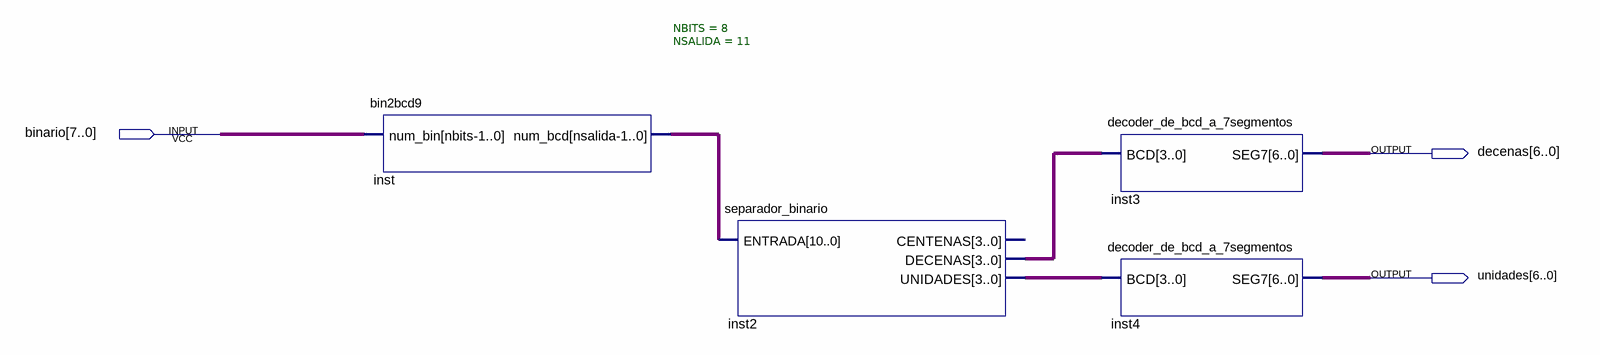
[diagram p0: schematic sheet]
// Quartus schematic convertidor_prueba.bdf as structural Verilog: 4 symbols, 3 pins
module convertidor_prueba (
  input  [7:0] binario,
  output [6:0] decenas,
  output [6:0] unidades
);

  wire [3:0] inst2_decenas, inst2_unidades;
  wire [10:0] inst_num_bcd;

  bin2bcd9 #(.NBITS(8), .NSALIDA(11)) inst (.num_bin(binario), .num_bcd(inst_num_bcd));
  separador_binario inst2 (
    .ENTRADA(inst_num_bcd), .DECENAS(inst2_decenas), .UNIDADES(inst2_unidades));  // open: CENTENAS
  decoder_de_bcd_a_7segmentos inst3 (.BCD(inst2_decenas), .SEG7(decenas));
  decoder_de_bcd_a_7segmentos inst4 (.BCD(inst2_unidades), .SEG7(unidades));
endmodule
